# Altium schematic sheet 14 - JLINK Debugger.SchDoc
size B; CompanyName: Microchip Technology Inc.; Organization: Microchip Technology; Address1: 2355 West Chandler Blvd.; Address2: Chandler, AZ  85224; Address4: USA; SheetNumber: 15; SheetTotal: 15; SheetTitle: JLINK Debugger; Time: Time
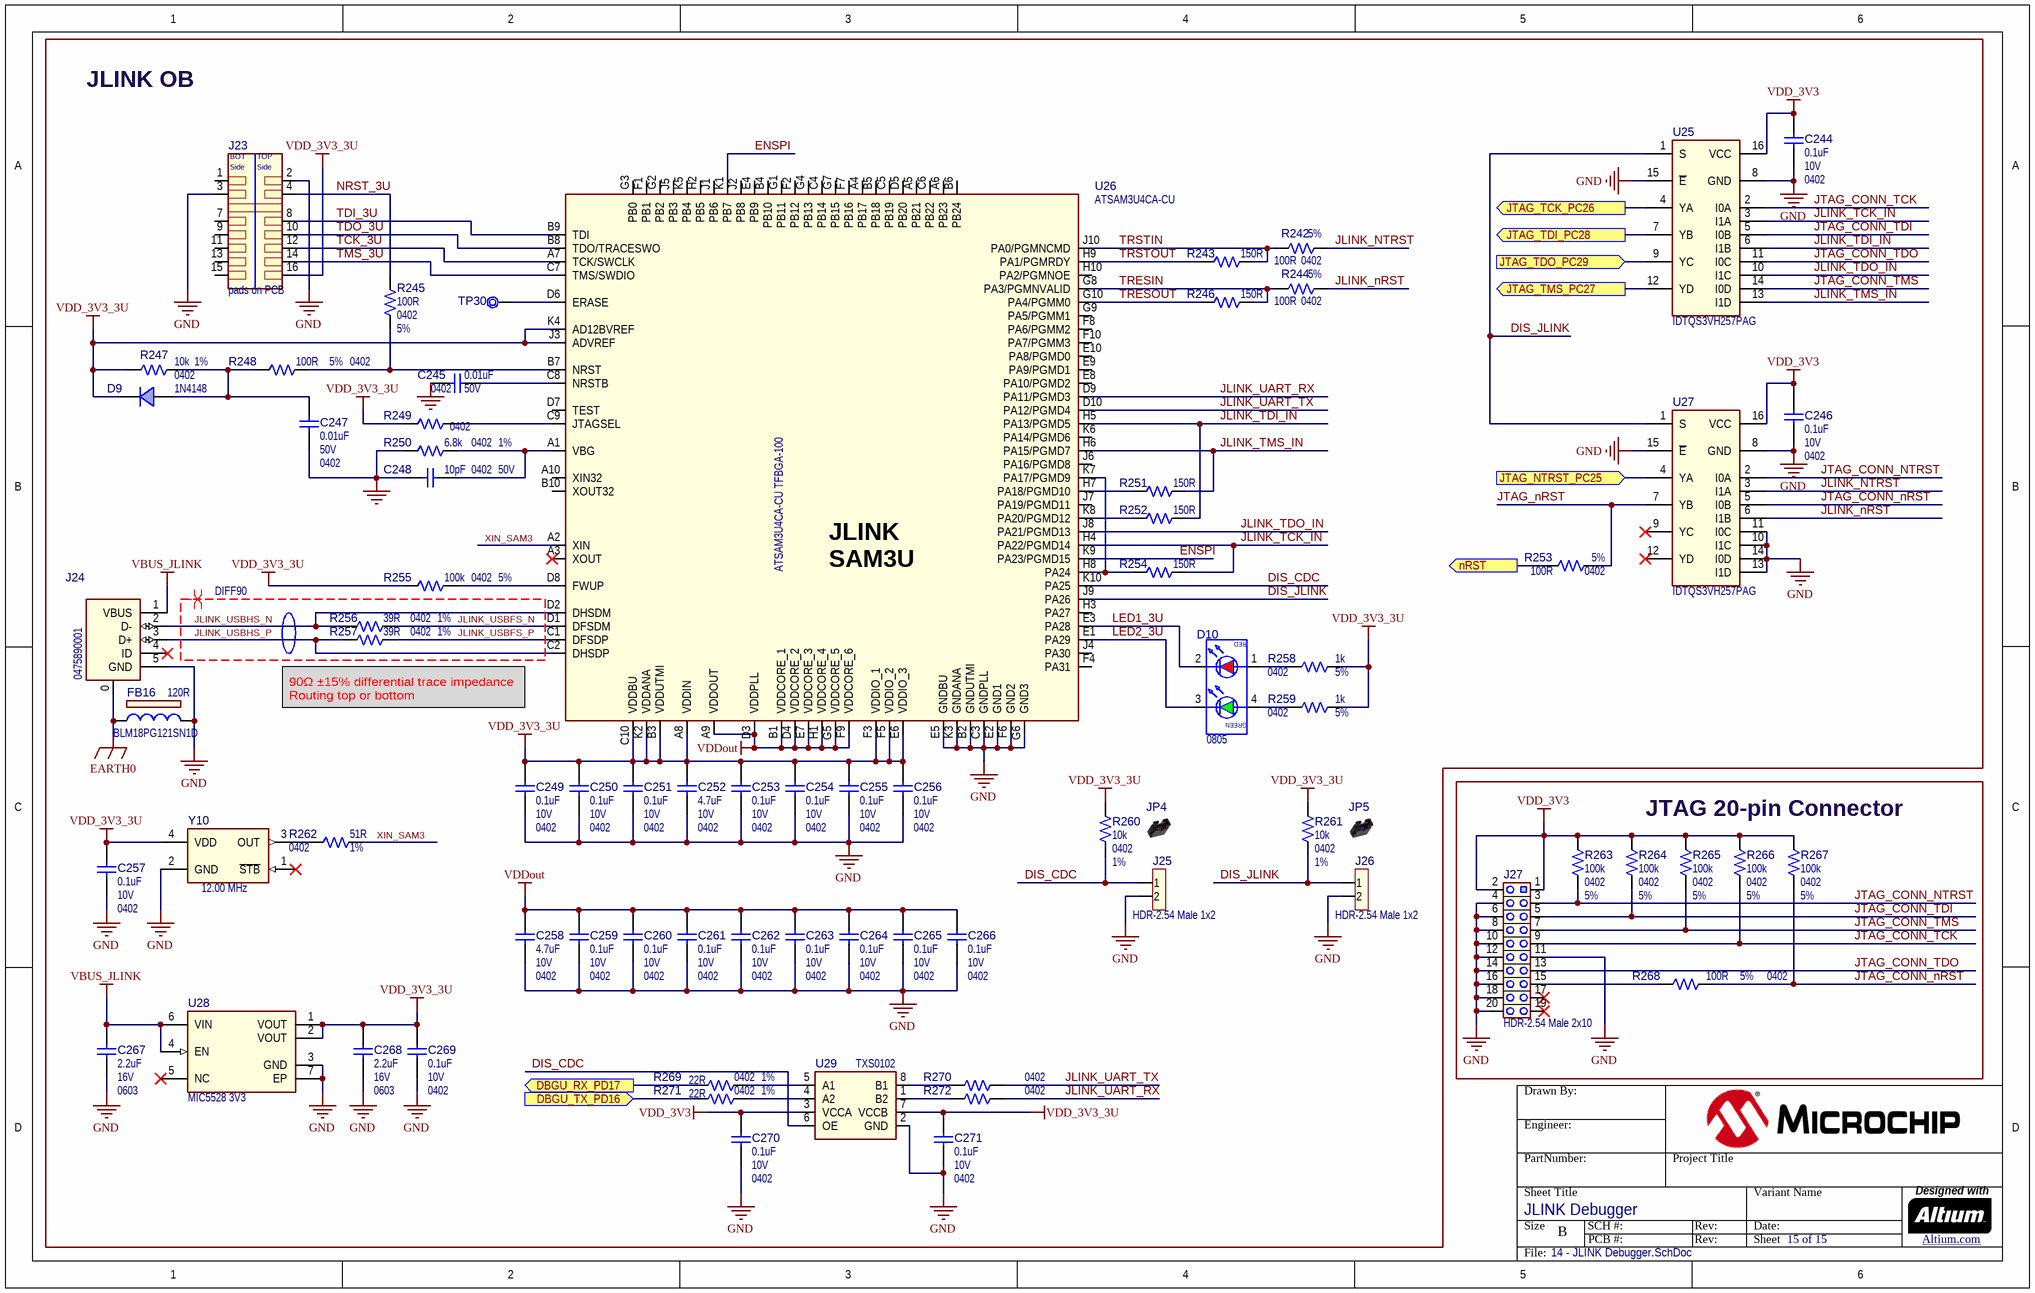
[diagram p0: 14 - JLINK Debugger.SchDoc]

## Parts
?  (no value)  (graphical)
C244  value 0.1uF  Voltage: 10V  Package: 0402  [CAP_C_0402]  (hidden comment: Capacitor NP)
C245  value 0.01uF  Voltage: 50V  Package: 0402  [CAP_C_0402]  (hidden comment: Capacitor NP)
C246  value 0.1uF  Voltage: 10V  Package: 0402  [CAP_C_0402]  (hidden comment: Capacitor NP)
C247  value 0.01uF  Voltage: 50V  Package: 0402  [CAP_C_0402]  (hidden comment: Capacitor NP)
C248  value 10pF  Voltage: 50V  Package: 0402  [CAP_C_0402]  (hidden comment: Capacitor NP)
C249  value 0.1uF  Voltage: 10V  Package: 0402  [CAP_C_0402]  (hidden comment: Capacitor NP)
C250  value 0.1uF  Voltage: 10V  Package: 0402  [CAP_C_0402]  (hidden comment: Capacitor NP)
C251  value 0.1uF  Voltage: 10V  Package: 0402  [CAP_C_0402]  (hidden comment: Capacitor NP)
C252  value 4.7uF  Voltage: 10V  Package: 0402  [CAP_C_0402]  (hidden comment: Capacitor NP)
C253  value 0.1uF  Voltage: 10V  Package: 0402  [CAP_C_0402]  (hidden comment: Capacitor NP)
C254  value 0.1uF  Voltage: 10V  Package: 0402  [CAP_C_0402]  (hidden comment: Capacitor NP)
C255  value 0.1uF  Voltage: 10V  Package: 0402  [CAP_C_0402]  (hidden comment: Capacitor NP)
C256  value 0.1uF  Voltage: 10V  Package: 0402  [CAP_C_0402]  (hidden comment: Capacitor NP)
C257  value 0.1uF  Voltage: 10V  Package: 0402  [CAP_C_0402]  (hidden comment: Capacitor NP)
C258  value 4.7uF  Voltage: 10V  Package: 0402  [CAP_C_0402]  (hidden comment: Capacitor NP)
C259  value 0.1uF  Voltage: 10V  Package: 0402  [CAP_C_0402]  (hidden comment: Capacitor NP)
C260  value 0.1uF  Voltage: 10V  Package: 0402  [CAP_C_0402]  (hidden comment: Capacitor NP)
C261  value 0.1uF  Voltage: 10V  Package: 0402  [CAP_C_0402]  (hidden comment: Capacitor NP)
C262  value 0.1uF  Voltage: 10V  Package: 0402  [CAP_C_0402]  (hidden comment: Capacitor NP)
C263  value 0.1uF  Voltage: 10V  Package: 0402  [CAP_C_0402]  (hidden comment: Capacitor NP)
C264  value 0.1uF  Voltage: 10V  Package: 0402  [CAP_C_0402]  (hidden comment: Capacitor NP)
C265  value 0.1uF  Voltage: 10V  Package: 0402  [CAP_C_0402]  (hidden comment: Capacitor NP)
C266  value 0.1uF  Voltage: 10V  Package: 0402  [CAP_C_0402]  (hidden comment: Capacitor NP)
C267  value 2.2uF  Voltage: 16V  Package: 0603  [CAP_C_0603]  (hidden comment: Capacitor NP)
C268  value 2.2uF  Voltage: 16V  Package: 0603  [CAP_C_0603]  (hidden comment: Capacitor NP)
C269  value 0.1uF  Voltage: 10V  Package: 0402  [CAP_C_0402]  (hidden comment: Capacitor NP)
C270  value 0.1uF  Voltage: 10V  Package: 0402  [CAP_C_0402]  (hidden comment: Capacitor NP)
C271  value 0.1uF  Voltage: 10V  Package: 0402  [CAP_C_0402]  (hidden comment: Capacitor NP)
D9  value 1N4148  [SOD-323]  (hidden comment: Diode Single)
D10  Package: 0805  [LED_DUAL_SMD_2x1.25mm]  (hidden comment: LED DUAL 4 pin)
FB16  value 120R  Manufacturer Part Number 1: BLM18PG121SN1D  [IND_C_0603]  (hidden comment: Ferrite Bead)
J23  pads on PCB  [CON_EDGE-CARD_PCB_RA_MEC1-108-02-F-D-RA1-SL]  (no BOM)
J24  value 0475890001  [CON_USB_Micro-AB_SMD_RA_MOLEX_0475890001]  (hidden comment: CON USB2.0 Mini_Micro)
J25  value HDR-2.54 Male 1x2  [HDR_M_2.54_1x2]  (hidden comment: Header 1x2)
J26  value HDR-2.54 Male 1x2  [HDR_M_2.54_1x2]  (hidden comment: Header 1x2)
J27  value HDR-2.54 Male 2x10  [HDR_M_2.54_2X10_S_TH_V_SAM_TST-110-01-G-D]  (hidden comment: Header 2x10)
JP4  Jumper Mechanical  [Jumper_Mechanical]  (value not drawn)  (mechanical)
JP5  Jumper Mechanical  [Jumper_Mechanical]  (value not drawn)  (mechanical)
R242  value 100R  Package: 0402  Tolerance: 5%  [RES_C_0402]  (hidden comment: Resistor)
R243  value 150R  [RES_C_0402]  (hidden comment: Resistor)
R244  value 100R  Package: 0402  Tolerance: 5%  [RES_C_0402]  (hidden comment: Resistor)
R245  value 100R  Package: 0402  Tolerance: 5%  [RES_C_0402]  (hidden comment: Resistor)
R246  value 150R  [RES_C_0402]  (hidden comment: Resistor)
R247  value 10k  Package: 0402  Tolerance: 1%  [RES_C_0402]  (hidden comment: Resistor)
R248  value 100R  Package: 0402  Tolerance: 5%  [RES_C_0402]  (hidden comment: Resistor)
R249  Package: 0402  [RES_C_0402]  (hidden comment: Resistor)
R250  value 6.8k  Package: 0402  Tolerance: 1%  [RES_C_0402]  (hidden comment: Resistor)
R251  value 150R  [RES_C_0402]  (hidden comment: Resistor)
R252  value 150R  [RES_C_0402]  (hidden comment: Resistor)
R253  value 100R  Package: 0402  Tolerance: 5%  [RES_C_0402]  (hidden comment: Resistor)
R254  value 150R  [RES_C_0402]  (hidden comment: Resistor)
R255  value 100k  Package: 0402  Tolerance: 5%  [RES_C_0402]  (hidden comment: Resistor)
R256  value 39R  Package: 0402  Tolerance: 1%  [RES_C_0402]  (hidden comment: Resistor)
R257  value 39R  Package: 0402  Tolerance: 1%  [RES_C_0402]  (hidden comment: Resistor)
R258  value 1k  Package: 0402  Tolerance: 5%  [RES_C_0402]  (hidden comment: Resistor)
R259  value 1k  Package: 0402  Tolerance: 5%  [RES_C_0402]  (hidden comment: Resistor)
R260  value 10k  Package: 0402  Tolerance: 1%  [RES_C_0402]  (hidden comment: Resistor)
R261  value 10k  Package: 0402  Tolerance: 1%  [RES_C_0402]  (hidden comment: Resistor)
R262  value 51R  Package: 0402  Tolerance: 1%  [RES_C_0402]  (hidden comment: Resistor)
R263  value 100k  Package: 0402  Tolerance: 5%  [RES_C_0402]  (hidden comment: Resistor)
R264  value 100k  Package: 0402  Tolerance: 5%  [RES_C_0402]  (hidden comment: Resistor)
R265  value 100k  Package: 0402  Tolerance: 5%  [RES_C_0402]  (hidden comment: Resistor)
R266  value 100k  Package: 0402  Tolerance: 5%  [RES_C_0402]  (hidden comment: Resistor)
R267  value 100k  Package: 0402  Tolerance: 5%  [RES_C_0402]  (hidden comment: Resistor)
R268  value 100R  Package: 0402  Tolerance: 5%  [RES_C_0402]  (hidden comment: Resistor)
R269  value 22R  Package: 0402  Tolerance: 1%  [RES_C_0402]  (hidden comment: Resistor)
R270  Package: 0402  [RES_C_0402]  (hidden comment: Resistor)
R271  value 22R  Package: 0402  Tolerance: 1%  [RES_C_0402]  (hidden comment: Resistor)
R272  Package: 0402  [RES_C_0402]  (hidden comment: Resistor)
TP30  Test Point No BOM  [TP_1mm_SMD]  (value not drawn)  (no BOM)
U25  value IDTQS3VH257PAG  [TSSOP-16]  (hidden comment: IDTQS3VH257 TSSOP-16)
U26  ATSAM3U4CA-CU TFBGA-100  value ATSAM3U4CA-CU  [TFBGA-100_P0.8_9x9x1.1]
U27  value IDTQS3VH257PAG  [TSSOP-16]  (hidden comment: IDTQS3VH257 TSSOP-16)
U28  value MIC5528 3V3  [DFN-6_1.2x1.2]  (hidden comment: MIC5528MT DFN-6)
U29  TXS0102  [US-8]
Y10  value 12.00 MHz  [OSCILLATOR_DSC60000L2.5W2.0H0.89]  (hidden comment: OSCILLATOR DSC60XX)

## Blocks framed on the sheet
JTAG 20-pin Connector: J27 R263-R268

## Ports
DBGU_RX_PD17 (out), DBGU_TX_PD16 (in), JTAG_NTRST_PC25 (in), JTAG_TCK_PC26 (out), JTAG_TDI_PC28 (out), JTAG_TDO_PC29 (in), JTAG_TMS_PC27 (out), nRST (out)

## Nets
EARTH0: FB16.1 J24.0(SHLD)
GND: C244.2 C245.1 C246.2 C247.1 C248.2 C249.2 C250.1 C251.2 C252.1 C253.1 C254.1 C255.1 C256.1 C257.1 C258.1 C259.1 C260.2 C261.2 C262.2 C263.2 C264.2 C265.2 C266.1 C267.2 C268.1 C269.1 C270.1 C271.1 FB16.2 J23.2 J23.3 J24.5(GND) J25.2 J26.2 J27.4 J27.6 J27.8 J27.10 J27.11 J27.12 J27.14 J27.16 J27.18 J27.20 R250.1 U25.8(GND) U25.15(~{E}) U26.B2(GNDUTMI) U26.C3(GNDPLL) U26.E2(GND1) U26.E5(GNDBU) U26.F6(GND2) U26.G6(GND3) U26.K3(GNDANA) U27.8(GND) U27.10(I1C) U27.11(I0C) U27.13(I1D) U27.14(I0D) U27.15(~{E}) U28.3(GND) U28.7(EP) U29.2(GND) Y10.2(GND)
VBUS_JLINK: C267.1 J24.1(VBUS) U28.4(EN) U28.6(VIN)
VDD_3V3: C244.1 C246.1 C270.2 J27.1 J27.2 R263.2 R264.2 R265.2 R266.1 R267.2 U25.16(VCC) U27.16(VCC) U29.3(VCCA)
VDD_3V3_3U: C249.1 C250.2 C251.1 C252.2 C253.2 C254.2 C255.2 C256.2 C257.2 C268.2 C269.2 C271.2 D9.2(K) J23.16 R247.1 R249.1 R255.1 R258.1 R259.1 R260.1 R261.1 U26.A8(VDDIN) U26.B3(VDDUTMI) U26.C10(VDDBU) U26.E6(VDDIO_3) U26.F3(VDDIO_1) U26.F5(VDDIO_2) U26.J3(ADVREF) U26.K2(VDDANA) U26.K4(AD12BVREF) U28.1(VOUT) U28.2(VOUT) U29.7(VCCB) Y10.4(VDD)
VDDout: C258.2 C259.2 C260.1 C261.1 C262.1 C263.1 C264.1 C265.1 C266.2 U26.A9(VDDOUT) U26.B1(VDDCORE_1) U26.D3(VDDPLL) U26.D4(VDDCORE_2) U26.E7(VDDCORE_3) U26.F9(VDDCORE_6) U26.G5(VDDCORE_5) U26.H1(VDDCORE_4)
DBGU_RX_PD17: R269.1 ; port DBGU_RX_PD17
DBGU_TX_PD16: R271.1 ; port DBGU_TX_PD16
DIS_CDC: J25.1 R260.2 U26.K10(PA25) U29.6(OE)
DIS_JLINK: J26.1 R261.2 U25.1(S) U26.J9(PA26) U27.1(S)
ENSPI: U26.K1(PB7) U26.K9(PA23/PGMD15)
JLINK_nRST: R244.2 U27.6(I1B)
JLINK_NTRST: R242.2 U27.3(I1A)
JLINK_TCK_IN: R254.2 U25.3(I1A) U26.H4(PA22/PGMD14)
JLINK_TDI_IN: R252.2 U25.6(I1B) U26.H5(PA13/PGMD5)
JLINK_TDO_IN: U25.10(I1C) U26.J8(PA21/PGMD13)
JLINK_TMS_IN: R251.2 U25.13(I1D) U26.H6(PA15/PGMD7)
JLINK_UART_RX: R272.2 U26.D9(PA11/PGMD3)
JLINK_UART_TX: R270.2 U26.D10(PA12/PGMD4)
JLINK_USBFS_N: R256.2 U26.D1(DFSDM)
JLINK_USBFS_P: R257.2 U26.C1(DFSDP)
JLINK_USBHS_N: J24.2(D-) R256.1 U26.D2(DHSDM)
JLINK_USBHS_P: J24.3(D+) R257.1 U26.C2(DHSDP)
JTAG_CONN_nRST: R267.1 R268.1 U27.5(I0B)
JTAG_CONN_NTRST: J27.3 R263.1 U27.2(I0A)
JTAG_CONN_TCK: J27.9 R266.2 U25.2(I0A)
JTAG_CONN_TDI: J27.5 R264.1 U25.5(I0B)
JTAG_CONN_TDO: J27.13 U25.11(I0C)
JTAG_CONN_TMS: J27.7 R265.1 U25.14(I0D)
JTAG_nRST: R253.2 U27.7(YB)
JTAG_NTRST_PC25: U27.4(YA) ; port JTAG_NTRST_PC25
JTAG_TCK_PC26: U25.4(YA) ; port JTAG_TCK_PC26
JTAG_TDI_PC28: U25.7(YB) ; port JTAG_TDI_PC28
JTAG_TDO_PC29: U25.9(YC) ; port JTAG_TDO_PC29
JTAG_TMS_PC27: U25.12(YD) ; port JTAG_TMS_PC27
LED1_3U: D10.2(K1) U26.E3(PA28)
LED2_3U: D10.3(K2) U26.E1(PA29)
nRST: R253.1 ; port nRST
NRST_3U: J23.4 R245.2
TCK_3U: J23.12 U26.A7(TCK/SWCLK)
TDI_3U: J23.8 U26.B9(TDI)
TDO_3U: J23.10 U26.B8(TDO/TRACESWO)
TMS_3U: J23.14 U26.C7(TMS/SWDIO)
TRESIN: R244.1 R246.2 U26.G8(PA3/PGMNVALID)
TRESOUT: R246.1 U26.G10(PA4/PGMM0)
TRSTIN: R242.1 R243.2 U26.J10(PA0/PGMNCMD)
TRSTOUT: R243.1 U26.H9(PA1/PGMRDY)
XIN_SAM3: R262.2 U26.A2(XIN)
NetC245_2: C245.2 U26.C8(NRSTB)
NetC247_2: C247.2 D9.1(A) R247.2 R248.1
NetC248_1: C248.1 R250.2 U26.A1(VBG)
NetD10_1: D10.1(A1) R258.2
NetD10_4: D10.4(A2) R259.2
NetJ27_15: J27.15 R268.2
NetR245_1: R245.1 R248.2 U26.B7(NRST)
NetR249_2: R249.2 U26.C9(JTAGSEL)
NetR251_1: R251.1 U26.H7(PA18/PGMD10)
NetR252_1: R252.1 U26.K8(PA20/PGMD12)
NetR254_1: R254.1 U26.H8(PA24) U26.K7(PA17/PGMD9)
NetR255_2: R255.2 U26.D8(FWUP)
NetR262_1: R262.1 Y10.3(OUT)
NetR269_2: R269.2 U29.5(A1)
NetR270_1: R270.1 U29.8(B1)
NetR271_2: R271.2 U29.4(A2)
NetR272_1: R272.1 U29.1(B2)
NetTP30_1: TP30.1 U26.D6(ERASE)

Not connected (* = marked no-connect by the designer): J23 1 7 9 11 13 15; J24 4(ID)*; J27 17* 19*; U26 A3(XOUT)* A4(PB17) A5(PB21) A6(PB23) A10(XIN32) B4(PB10) B5(PB18) B6(PB24) B10(XOUT32) C4(PB14) C5(PB19) C6(PB22) D5(PB20) D7(TEST) E4(PB9) E8(PA10/PGMD2) E9(PA9/PGMD1) E10(PA8/PGMD0) F1(PB1) F2(PB12) F4(PA31) F7(PB16) F8(PA6/PGMM2) F10(PA7/PGMM3) G1(PB11) G2(PB2) G3(PB0) G4(PB13) G7(PB15) G9(PA5/PGMM1) H2(PB5) H3(PA27) H10(PA2/PGMNOE) J1(PB6) J2(PB8) J4(PA30) J5(PB3) J6(PA16/PGMD8) J7(PA19/PGMD11) K5(PB4) K6(PA14/PGMD6); U27 9(YC)* 12(YD)*; U28 5(NC)*; Y10 1(~{STB})*

## Layout directives
differential pair; differential pair class DIFF90; net class DIFF90; rule Matched Net Lengths [Tolerance = 0.1mm]: JLINK_USBFS_N, JLINK_USBFS_P, JLINK_USBHS_N, JLINK_USBHS_P

## Notes on the sheet
- JLINK OB
- (near U26) JLINK
  SAM3U
- 90Ω ±15% differential trace impedance
  Routing top or bottom
- Drawn By:
- Engineer:
- PartNumber:
- Project Title
- Sheet Title
- Size
- B
- SCH #:
- PCB #:
- Rev:
- Variant Name
- Date:
- Sheet
- Designed with
- Altium.com <http://go.altium.com/MicrochipLandingPage_Evaluation.html>
- File:
- (in symbol CON1674) BOT; TOP; Side
- (in symbol DIODE1110) RED; GREEN

## Library data of the parts
? = Title Block B
C244 C246 C249-C251 C253-C257 C259-C266 C269-C271 = CAP1238: Capacitor; Manufacturer 1: KEMET; Manufacturer Part Number 1: C0402C104K8RACTU; Description_: CAP CER 0.1uF 10V 10% X7R SMD 0402; Dev Tools Status: Production; Tolerance: 10%; Temperature Coeffcient: X7R; Type: Ceramic; Owner: Tad Ahlvers; Populated: YES; MCHP-ID: CAP1238; Revision: 1; Symbol: Capacitor NP; Status: MCL Design; ComponentLink1URL: https://chn-vm-apps.microchip.com/mchprepo/parts/Datasheets/KEM_C1002_X7R_SMD.pdf; ComponentLink1Description: SVN Datasheet; ComponentLink2URL: C:\ALTIUM_WORK\00001_MCHP-CDB\Datasheets\KEM_C1002_X7R_SMD.pdf; ComponentLink2Description: Local Datasheet; ComponentLink3URL: C:\ALTIUM_WORK\00001_MCHP-CDB\Library\LibraryRefs\Capacitor NP.SchLib; ComponentLink3Description: Open Symbol; ComponentLink4URL: C:\ALTIUM_WORK\00001_MCHP-CDB\Library\Footprints\CAP_C_0402.PcbLib; ComponentLink4Description: Open Footprint; ComponentLink5Description: Open Footprint 2; ComponentLink6Description: Open Footprint 3; ComponentLink7Description: Open Footprint 4; Operating Temperature: -55C to +125C; Category: Capacitor; Supplier 1: Digi-Key; Supplier Part Number 1: 399-3520-2-ND; Quantity Override: 1; Manufacturer 2: Samsung; Manufacturer Part Number 2: CL05B104KP5NNNC; Manufacturer 3: Murata Electronics; Manufacturer Part Number 3: GRM155R71A104KA01D; Supplier 2: Digi-Key; Supplier Part Number 2: 1276-1002-2-ND; Supplier 3: Mouser; Supplier Part Number 3: 81-GRM155R71A104KA1D
C245 C247 = CAP2026: Capacitor; Manufacturer 1: TDK Corporation; Manufacturer Part Number 1: CGA2B3X7R1H103K050BB; Description_: CAP CER 0.01uF 50V 10% X7R SMD 0402; Dev Tools Status: Design; Tolerance: 10%; Temperature Coeffcient: X7R; Type: Ceramic; Populated: YES; Owner: Gabor Bihari; MCHP-ID: CAP2026; Revision: A; Symbol: Capacitor NP; Status: MCL Design; ComponentLink1URL: https://chn-vm-apps.microchip.com/mchprepo/parts/Datasheets/mlcc_automotive_general_en.pdf; ComponentLink1Description: SVN Datasheet; ComponentLink2URL: C:\ALTIUM_WORK\00001_MCHP-CDB\Datasheets\mlcc_automotive_general_en.pdf; ComponentLink2Description: Local Datasheet; ComponentLink3URL: C:\ALTIUM_WORK\00001_MCHP-CDB\Library\LibraryRefs\Capacitor NP.SchLib; ComponentLink3Description: Open Symbol; ComponentLink4URL: C:\ALTIUM_WORK\00001_MCHP-CDB\Library\Footprints\CAP_C_0402.PcbLib; ComponentLink4Description: Open Footprint; ComponentLink5Description: Open Footprint 2; ComponentLink6Description: Open Footprint 3; ComponentLink7Description: Open Footprint 4; Operating Temperature: -55C to +125C; Category: Capacitor; Supplier 1: Digi-Key; Supplier Part Number 1: 445-6893-1-ND; Quantity Override: 1
C248 = CAP2117: Manufacturer 1: Samsung Electro-Mechanics; Manufacturer Part Number 1: CL05C100JB51PNC; Description_: CAP CER 10pF 5% 50V C0G/NP0 SMD 0402 AEC-Q200; Dev Tools Status: Design; Tolerance: 5%; Temperature Coeffcient: NP0; Type: Ceramic; Populated: YES; Owner: Gabor Bihari; MCHP-ID: CAP2117; Revision: A; Symbol: Capacitor NP; Status: MCL Design; ComponentLink1URL: https://chn-vm-apps.microchip.com/mchprepo/parts/Datasheets/MLCC.pdf; ComponentLink1Description: SVN Datasheet; ComponentLink2URL: C:\ALTIUM_WORK\00001_MCHP-CDB\Datasheets\MLCC.pdf; ComponentLink2Description: Local Datasheet; ComponentLink3URL: C:\ALTIUM_WORK\00001_MCHP-CDB\Library\LibraryRefs\Capacitor NP.SchLib; ComponentLink3Description: Open Symbol; ComponentLink4URL: C:\ALTIUM_WORK\00001_MCHP-CDB\Library\Footprints\CAP_C_0402.PcbLib; ComponentLink4Description: Open Footprint; ComponentLink5Description: Open Footprint 2; ComponentLink6Description: Open Footprint 3; ComponentLink7Description: Open Footprint 4; Operating Temperature: -55°C - 125°C; Category: Capacitor; Supplier 1: Digi-Key; Supplier Part Number 1: 1276-1626-1-ND; Quantity Override: 1
C252 C258 = CAP1684: Capacitor; Manufacturer 1: TDK Corporation; Manufacturer Part Number 1: C1005X5R1A475K050BC; Description_: CAP CER 4.7uF 10V 10% X5R SMD 0402; Dev Tools Status: Design; Tolerance: 10%; Temperature Coeffcient: X5R; Type: Ceramic; Owner: Jesus Aviles; Populated: YES; MCHP-ID: CAP1684; Revision: B; Symbol: Capacitor NP; Status: MCL Design; ComponentLink1Description: SVN Datasheet; ComponentLink2Description: Local Datasheet; ComponentLink3URL: C:\ALTIUM_WORK\00001_MCHP-CDB\Library\LibraryRefs\Capacitor NP.SchLib; ComponentLink3Description: Open Symbol; ComponentLink4URL: C:\ALTIUM_WORK\00001_MCHP-CDB\Library\Footprints\CAP_C_0402.PcbLib; ComponentLink4Description: Open Footprint; ComponentLink5Description: Open Footprint 2; ComponentLink6Description: Open Footprint 3; ComponentLink7Description: Open Footprint 4; Operating Temperature: -55C to 85C; Category: Capacitor; Supplier 1: Digi-Key; Supplier Part Number 1: 445-13820-1-ND; Quantity Override: 1
C267 C268 = CAP0597: Capacitor; Manufacturer 1: TDK; Manufacturer Part Number 1: C1608X5R1C225K; Description_: CAP CER 2.2uF 16V 10% X5R SMD 0603; Dev Tools Status: Production; Tolerance: 10%; Temperature Coeffcient: X5R; Type: Ceramic; Populated: Yes; MCHP-ID: CAP0597; Revision: 2; Symbol: Capacitor NP; Status: MCL Design; ComponentLink1URL: https://chn-vm-apps.microchip.com/mchprepo/parts/Datasheets/general_B11.pdf; ComponentLink1Description: SVN Datasheet; ComponentLink2URL: C:\ALTIUM_WORK\00001_MCHP-CDB\Datasheets\general_B11.pdf; ComponentLink2Description: Local Datasheet; ComponentLink3URL: C:\ALTIUM_WORK\00001_MCHP-CDB\Library\LibraryRefs\Capacitor NP.SchLib; ComponentLink3Description: Open Symbol; ComponentLink4URL: C:\ALTIUM_WORK\00001_MCHP-CDB\Library\Footprints\CAP_C_0603.PcbLib; ComponentLink4Description: Open Footprint; ComponentLink5Description: Open Footprint 2; ComponentLink6Description: Open Footprint 3; ComponentLink7Description: Open Footprint 4; Operating Temperature: -55C to +85C; Category: Capacitor; Supplier 1: Digi-Key; Supplier Part Number 1: 445-5157-1-ND; Quantity Override: 1
D9 = DIODE0096: DIO RECT 1N4148 855mV 300mA 75V SOD-323; Manufacturer 1: Diodes Incorporated; Manufacturer Part Number 1: 1N4148WS-7-F; Dev Tools Status: Production; Type: Rectifier Single; Power: 200mW; Reverse Current: 50uA; Populated: Yes; MCHP-ID: DIODE0096; Revision: 1; Symbol: Diode Single; Description_: DIO RECT 1N4148 855mV 300mA 75V SOD-323; Status: MCL Design; Package: SOD-323; ComponentLink1URL: https://chn-vm-apps.microchip.com/mchprepo/parts/Datasheets/ds30097.pdf; ComponentLink1Description: SVN Datasheet; ComponentLink2URL: C:\ALTIUM_WORK\00001_MCHP-CDB\Datasheets\ds30097.pdf; ComponentLink2Description: Local Datasheet; ComponentLink3URL: C:\ALTIUM_WORK\00001_MCHP-CDB\Library\LibraryRefs\Diode Single.SchLib; ComponentLink3Description: Open Symbol; ComponentLink4URL: C:\ALTIUM_WORK\00001_MCHP-CDB\Library\Footprints\SOD-323.PcbLib; ComponentLink4Description: Open Footprint; ComponentLink5Description: Open Footprint 2; ComponentLink6Description: Open Footprint 3; ComponentLink7Description: Open Footprint 4; Operating Temperature: -65C to +150C; Category: Diode; Forward Current: 300mA; Reverse Voltage: 75V; Manufacturer 2: Diodes Incorporated; Manufacturer Part Number 2: 1N4148WS-7; Supplier 1: Digi-Key; Supplier Part Number 1: 1N4148WS-FDICT-ND; Supplier 2: Digi-Key; Supplier Part Number 2: 1N4148WSDITR-ND; Quantity Override: 1
D10 = DIODE1110: LED; Manufacturer 1: Kingbright Corp; Manufacturer Part Number 1: APHBM2012SURKCGKC; Value: RED, GREEN; Description_: DIO LED BI RED, GREEN 1.95V, 2.1V 30mA 0805; Dev Tools Status: Production; Type: LED Bicolor; Forward Current: 30mA; Power: 75mW; Reverse Current: 10uA; Owner: Bogdan P (M91398); Populated: Yes; MCHP-ID: DIODE1110; Revision: 0; Symbol: LED DUAL 4 PIN; Status: MCL Design; ComponentLink1URL: https://chn-vm-apps.microchip.com/mchprepo/parts/Datasheets/APHBM2012SURKCGKC.pdf; ComponentLink1Description: SVN Datasheet; ComponentLink2URL: C:\ALTIUM_WORK\00001_MCHP-CDB\Datasheets\APHBM2012SURKCGKC.pdf; ComponentLink2Description: Local Datasheet; ComponentLink3URL: C:\ALTIUM_WORK\00001_MCHP-CDB\Library\LibraryRefs\LED DUAL 4 PIN.SchLib; ComponentLink3Description: Open Symbol; ComponentLink4URL: C:\ALTIUM_WORK\00001_MCHP-CDB\Library\Footprints\LED_DUAL_SMD_2x1.25mm.PcbLib; ComponentLink4Description: Open Footprint; ComponentLink5Description: Open Footprint 2; ComponentLink6Description: Open Footprint 3; ComponentLink7Description: Open Footprint 4; Operating Temperature: -40C to +85C; Category: Diode; Supplier 1: Digi-Key; Supplier Part Number 1: 754-1093-1-ND; Quantity Override: 1
FB16 = IND1009: Manufacturer 1: Murata; Description_: FERRITE 120R@100MHz 2A SMD 0603; Dev Tools Status: Production; Owner: Petnarong Chaijaroong; DCR: 0.05R; Saturation Current: 12A; Populated: Yes; MCHP-ID: IND1009; Revision: 0; Symbol: Ferrite Bead; Status: MCL Design; ComponentLink1URL: https://chn-vm-apps.microchip.com/mchprepo/parts/Datasheets/L0110S0100BLM18P.pdf; ComponentLink1Description: SVN Datasheet; ComponentLink2URL: C:\ALTIUM_WORK\00001_MCHP-CDB\Datasheets\L0110S0100BLM18P.pdf; ComponentLink2Description: Local Datasheet; ComponentLink3URL: C:\ALTIUM_WORK\00001_MCHP-CDB\Library\LibraryRefs\Ferrite Bead.SchLib; ComponentLink3Description: Open Symbol; ComponentLink4URL: C:\ALTIUM_WORK\00001_MCHP-CDB\Library\Footprints\IND_C_0603.PcbLib; ComponentLink4Description: Open Footprint; ComponentLink5Description: Open Footprint 2; ComponentLink6Description: Open Footprint 3; ComponentLink7Description: Open Footprint 4; Operating Temperature: -55C to +125C; Package: 0603; Type: Ferrite Bead; Category: Inductor; Supplier 1: Digi-Key; Supplier Part Number 1: 490-1037-1-ND; Quantity Override: 1
J23 = CON1674: CON_PCB_MEC1-108-02-F-D-RA1-SL; Manufacturer 1: Samtec Inc.; Description_: CON EDGE MEC1 1mm 14P Male PCB VERT; Dev Tools Status: Design; Owner: Dragos Danaila; Current: 1.6A; Populated: NO; MCHP-ID: CON1674; Revision: C; Symbol: CON_PCB_MEC1-108-02-F-D-RA1-SL; Status: MCL Design; ComponentLink1URL: https://chn-vm-apps.microchip.com/mchprepo/parts/Datasheets/mec1-1xx-xx-x-d-rax-x-sl-footprint.pdf; ComponentLink1Description: SVN Datasheet; ComponentLink2URL: C:\ALTIUM_WORK\00001_MCHP-CDB\Datasheets\mec1-1xx-xx-x-d-rax-x-sl-footprint.pdf; ComponentLink2Description: Local Datasheet; ComponentLink3URL: C:\ALTIUM_WORK\00001_MCHP-CDB\Library\LibraryRefs\CON_PCB_MEC1-108-02-F-D-RA1-SL.SchLib; ComponentLink3Description: Open Symbol; ComponentLink4URL: C:\ALTIUM_WORK\00001_MCHP-CDB\Library\Footprints\CON_EDGE-CARD_PCB_RA_MEC1-108-02-F-D-RA1-SL.PcbLib; ComponentLink4Description: Open Footprint; ComponentLink5Description: Open Footprint 2; ComponentLink6Description: Open Footprint 3; ComponentLink7Description: Open Footprint 4; Type: Edge Card; Category: Connector; Manufacturer Part Number 1: MEC1-108-02-F-D-RA1-SL; Supplier 1: Digi-Key; Supplier Part Number 1: SAM11473-ND; Quantity Override: 1
J24 = CON1753: Manufacturer 1: Molex, LLC; Description_: CON USB2.0 MICRO-AB FEMALE SMD R/A; Dev Tools Status: Design; Owner: Dragos Danaila; Populated: YES; Voltage: 30VAC; Current: 1A, 1.8A; Custom Parameters: 10000 mating cycles; MCHP-ID: CON1753; Revision: A; Symbol: CON USB2.0 Mini_Micro; Status: MCL Design; ComponentLink1URL: https://chn-vm-apps.microchip.com/mchprepo/parts/Datasheets/475890001_sd.pdf; ComponentLink1Description: SVN Datasheet; ComponentLink2URL: C:\ALTIUM_WORK\00001_MCHP-CDB\Datasheets\475890001_sd.pdf; ComponentLink2Description: Local Datasheet; ComponentLink3URL: C:\ALTIUM_WORK\00001_MCHP-CDB\Library\LibraryRefs\CON USB2.0 Mini_Micro.SchLib; ComponentLink3Description: Open Symbol; ComponentLink4URL: C:\ALTIUM_WORK\00001_MCHP-CDB\Library\Footprints\CON_USB_Micro-AB_SMD_RA_MOLEX_0475890001.PcbLib; ComponentLink4Description: Open Footprint; ComponentLink5Description: Open Footprint 2; ComponentLink6Description: Open Footprint 3; ComponentLink7Description: Open Footprint 4; Type: USB; Category: Connector; Manufacturer Part Number 1: 0475890001; Supplier 1: Digi-Key; Supplier Part Number 1: WM17143CT-ND; Quantity Override: 1
J25 J26 = CON1312: Manufacturer 1: Sullins Connector Solutions; Manufacturer Part Number 1: PREC002SAAN-RC; Description_: CON HDR-2.54 Male 1x2 Tin 5.84MH TH VERT; Dev Tools Status: Production; Owner: Randolph Sobrepena; Populated: YES; MCHP-ID: CON1312; Revision: 2; Symbol: Header 1x2; Status: MCL Design; ComponentLink1URL: https://chn-vm-apps.microchip.com/mchprepo/parts/Datasheets/z RzCzzzSzzN-RC, ST,11635-B.pdf; ComponentLink1Description: SVN Datasheet; ComponentLink2URL: C:\ALTIUM_WORK\00001_MCHP-CDB\Datasheets\z RzCzzzSzzN-RC, ST,11635-B.pdf; ComponentLink2Description: Local Datasheet; ComponentLink3URL: C:\ALTIUM_WORK\00001_MCHP-CDB\Library\LibraryRefs\Header 1x2.SchLib; ComponentLink3Description: Open Symbol; ComponentLink4URL: C:\ALTIUM_WORK\00001_MCHP-CDB\Library\Footprints\HDR_M_2.54_1x2.PcbLib; ComponentLink4Description: Open Footprint; ComponentLink5Description: Open Footprint 2; ComponentLink6Description: Open Footprint 3; ComponentLink7Description: Open Footprint 4; Type: Header 2.54mm; Category: Connector; Manufacturer 2: SHENZHEN JUNHAO ENGINEERING; Manufacturer Part Number 2: R-211-0211-0021-000; Supplier 1: Digi-Key; Supplier Part Number 1: S1012EC-02-ND; Supplier 2: Raynen; Supplier Part Number 2: CONN00252C01M; Quantity Override: 1
J27 = CON1576: Manufacturer 1: Samtec; Manufacturer Part Number 1: TST-110-01-G-D; Description_: CON HDR-2.54 Male 2x10 Gold Shroud 6.35MH TH VERT; Dev Tools Status: Production; Owner: Randolph Sobrepena; Populated: YES; MCHP-ID: CON1576; Revision: 1; Symbol: Header 2x10; Status: MCL Design; ComponentLink1URL: https://chn-vm-apps.microchip.com/mchprepo/parts/Datasheets/tst-mkt.pdf; ComponentLink1Description: SVN Datasheet; ComponentLink2URL: C:\ALTIUM_WORK\00001_MCHP-CDB\Datasheets\tst-mkt.pdf; ComponentLink2Description: Local Datasheet; ComponentLink3URL: C:\ALTIUM_WORK\00001_MCHP-CDB\Library\LibraryRefs\Header 2x10.SchLib; ComponentLink3Description: Open Symbol; ComponentLink4URL: C:\ALTIUM_WORK\00001_MCHP-CDB\Library\Footprints\HDR_M_2.54_2X10_S_TH_V_SAM_TST-110-01-G-D.PcbLib; ComponentLink4Description: Open Footprint; ComponentLink5Description: Open Footprint 2; ComponentLink6Description: Open Footprint 3; ComponentLink7Description: Open Footprint 4; Type: Header 2.54mm; Category: Connector; Supplier 1: Digi-Key; Supplier Part Number 1: SAM8994-ND; Quantity Override: 1; Manufacturer 2: Greenconn; Manufacturer Part Number 2: GPHA204-1002A001B1BB; Supplier 2: Greenconn; Supplier Part Number 2: GPHA204-1002A001B1BB
JP4 JP5 = MECH0174: Manufacturer 1: Wurth Electronics Inc.; Manufacturer Part Number 1: 60900213421; Value: Shunt 2.54mm 1x2; Description_: MECH HW JUMPER 2.54mm 1x2 GOLD; Dev Tools Status: Production; Owner: Narasimha Murthy; Populated: MECH; MCHP-ID: MECH0174; Revision: 1; Symbol: Jumper Mechanical; Status: MCL Design; ComponentLink1URL: https://chn-vm-apps.microchip.com/mchprepo/parts/Datasheets/60900213421.pdf; ComponentLink1Description: SVN Datasheet; ComponentLink2URL: C:\ALTIUM_WORK\00001_MCHP-CDB\Datasheets\60900213421.pdf; ComponentLink2Description: Local Datasheet; ComponentLink3URL: C:\ALTIUM_WORK\00001_MCHP-CDB\Library\LibraryRefs\Jumper Mechanical.SchLib; ComponentLink3Description: Open Symbol; ComponentLink4URL: C:\ALTIUM_WORK\00001_MCHP-CDB\Library\Footprints\Jumper_Mechanical.PcbLib; ComponentLink4Description: Open Footprint; ComponentLink5Description: Open Footprint 2; ComponentLink6Description: Open Footprint 3; ComponentLink7Description: Open Footprint 4; Type: Jumper; Category: Hardware; Supplier 1: Digi-Key; Supplier Part Number 1: 732-2678-ND; Quantity Override: 1
R242 R244 R245 R248 R253 R268 = RES2692: Manufacturer 1: Bourns Inc.; Manufacturer Part Number 1: CR0402AJW-101GAS; Description_: RES TKF 100R 5% 1/10W SMD 0402; Dev Tools Status: Design; Voltage: 50V; Temperature Coeffcient: 200ppm/C; Power: 1/16W; Owner: Dragos Danaila; Populated: YES; MCHP-ID: RES2692; Revision: 1; Symbol: Resistor; Status: MCL Design; ComponentLink1URL: https://chn-vm-apps.microchip.com/mchprepo/parts/Datasheets/crxxxxa-as.pdf; ComponentLink1Description: SVN Datasheet; ComponentLink2URL: C:\ALTIUM_WORK\00001_MCHP-CDB\Datasheets\crxxxxa-as.pdf; ComponentLink2Description: Local Datasheet; ComponentLink3URL: C:\ALTIUM_WORK\00001_MCHP-CDB\Library\LibraryRefs\Resistor.SchLib; ComponentLink3Description: Open Symbol; ComponentLink4URL: C:\ALTIUM_WORK\00001_MCHP-CDB\Library\Footprints\RES_C_0402.PcbLib; ComponentLink4Description: Open Footprint; ComponentLink5Description: Open Footprint 2; ComponentLink6Description: Open Footprint 3; ComponentLink7Description: Open Footprint 4; Operating Temperature: -55C to +155C; Category: Resistor; Type: RES SMD; Composition: TKF; Supplier 1: Digikey; Supplier Part Number 1: CR0402AJW-101GASTR-ND; Quantity Override: 1
R243 R246 R251 R252 R254 = RSMT1167: Manufacturer 1: Vishay Dale; Manufacturer Part Number 1: CRCW0402150RFKED; Description_: RES TKF 150R 1% 1/16W MF 0402; Dev Tools Status: Production; Owner: Jamus Griego; Populated: YES; MCHP-ID: RSMT1167; Revision: 1; Symbol: Resistor; Status: MCL Design; ComponentLink1URL: https://chn-vm-apps.microchip.com/mchprepo/parts/Datasheets/dcrcwe3.pdf; ComponentLink1Description: SVN Datasheet; ComponentLink2URL: C:\ALTIUM_WORK\00001_MCHP-CDB\Datasheets\dcrcwe3.pdf; ComponentLink2Description: Local Datasheet; ComponentLink3URL: C:\ALTIUM_WORK\00001_MCHP-CDB\Library\LibraryRefs\Resistor.SchLib; ComponentLink3Description: Open Symbol; ComponentLink4URL: C:\ALTIUM_WORK\00001_MCHP-CDB\Library\Footprints\RES_C_0402.PcbLib; ComponentLink4Description: Open Footprint; ComponentLink5Description: Open Footprint 2; ComponentLink6Description: Open Footprint 3; ComponentLink7Description: Open Footprint 4; Category: Resistor; Type: RES SMD; Supplier 1: Digi-Key; Supplier Part Number 1: 541-150LCT-ND; Quantity Override: 1
R247 R260 R261 = RSMT1019: Manufacturer 1: Panasonic; Manufacturer Part Number 1: ERJ-2RKF1002X; Description_: RES TKF 10k 1% 1/10W SMD 0402; Dev Tools Status: Production; Voltage: 50V; Temperature Coeffcient: 100ppm/C; Power: 1/10W; Populated: Yes; Owner: Brent Lanphear; MCHP-ID: RSMT1019; Revision: 2; Symbol: Resistor; Status: MCL Design; ComponentLink1URL: https://chn-vm-apps.microchip.com/mchprepo/parts/Datasheets/AOA0000CE2.pdf; ComponentLink1Description: SVN Datasheet; ComponentLink2URL: C:\ALTIUM_WORK\00001_MCHP-CDB\Datasheets\AOA0000CE2.pdf; ComponentLink2Description: Local Datasheet; ComponentLink3URL: C:\ALTIUM_WORK\00001_MCHP-CDB\Library\LibraryRefs\Resistor.SchLib; ComponentLink3Description: Open Symbol; ComponentLink4URL: C:\ALTIUM_WORK\00001_MCHP-CDB\Library\Footprints\RES_C_0402.PcbLib; ComponentLink4Description: Open Footprint; ComponentLink5Description: Open Footprint 2; ComponentLink6Description: Open Footprint 3; ComponentLink7Description: Open Footprint 4; Operating Temperature: -55C to +155C; Category: Resistor; Type: RES SMD; Composition: TKF; Supplier 1: Digi-Key; Supplier Part Number 1: P10.0KLCT-ND; Quantity Override: 1
R249 = RES2693: Manufacturer 1: Bourns Inc.; Manufacturer Part Number 1: CR0402-J/-000GLF; Description_: RES TKF 0R 1/16W SMD 0402; Dev Tools Status: Design; Power: 1/16W; Owner: Dragos Danaila; Populated: DNP; Voltage: 50V; Temperature Coeffcient: 100ppm/C; Current: 1A; MCHP-ID: RES2693; Revision: 1; Symbol: Resistor; Status: MCL Design; ComponentLink1URL: https://chn-vm-apps.microchip.com/mchprepo/parts/Datasheets/crxxxxx.pdf; ComponentLink1Description: SVN Datasheet; ComponentLink2URL: C:\ALTIUM_WORK\00001_MCHP-CDB\Datasheets\crxxxxx.pdf; ComponentLink2Description: Local Datasheet; ComponentLink3URL: C:\ALTIUM_WORK\00001_MCHP-CDB\Library\LibraryRefs\Resistor.SchLib; ComponentLink3Description: Open Symbol; ComponentLink4URL: C:\ALTIUM_WORK\00001_MCHP-CDB\Library\Footprints\RES_C_0402.PcbLib; ComponentLink4Description: Open Footprint; ComponentLink5Description: Open Footprint 2; ComponentLink6Description: Open Footprint 3; ComponentLink7Description: Open Footprint 4; Operating Temperature: -55C to +155C; Category: Resistor; Type: RES SMD; Composition: TKF; Supplier 1: Digikey; Supplier Part Number 1: CR0402-J/-000GLFTR-ND; Quantity Override: 1
R250 = RSMT1211: Manufacturer 1: Vishay Dale; Manufacturer Part Number 1: CRCW04026K80FKED; Description_: RES TKF 6.8k 1% 1/16W SMD 0402; Dev Tools Status: Design; Voltage: 50V; Temperature Coeffcient: 100ppm/C; Power: 1/16W; Owner: Dragos Danaila; Populated: YES; MCHP-ID: RSMT1211; Revision: A; Symbol: Resistor; Status: MCL Design; ComponentLink1URL: https://chn-vm-apps.microchip.com/mchprepo/parts/Datasheets/dcrcwe3.pdf; ComponentLink1Description: SVN Datasheet; ComponentLink2URL: C:\ALTIUM_WORK\00001_MCHP-CDB\Datasheets\dcrcwe3.pdf; ComponentLink2Description: Local Datasheet; ComponentLink3URL: C:\ALTIUM_WORK\00001_MCHP-CDB\Library\LibraryRefs\Resistor.SchLib; ComponentLink3Description: Open Symbol; ComponentLink4URL: C:\ALTIUM_WORK\00001_MCHP-CDB\Library\Footprints\RES_C_0402.PcbLib; ComponentLink4Description: Open Footprint; ComponentLink5Description: Open Footprint 2; ComponentLink6Description: Open Footprint 3; ComponentLink7Description: Open Footprint 4; Operating Temperature: -55C to +155C; Category: Resistor; Type: RES SMD; Composition: TKF; Supplier 1: Digi-Key; Supplier Part Number 1: 541-6.80KLCT-ND; Quantity Override: 1
R255 R263-R265 R267 = RSMT0737: Manufacturer 1: Panasonic; Manufacturer Part Number 1: ERJ-2GEJ104X; Description_: RES TKF 100k 5% 1/10W SMD 0402; Dev Tools Status: Production; Temperature Coeffcient: 200ppm/C; Power: 1/10W; Populated: Yes; Voltage: 50V; MCHP-ID: RSMT0737; Revision: 1; Symbol: Resistor; Status: MCL Design; ComponentLink1URL: https://chn-vm-apps.microchip.com/mchprepo/parts/Datasheets/AOA0000CE1.pdf; ComponentLink1Description: SVN Datasheet; ComponentLink2URL: C:\ALTIUM_WORK\00001_MCHP-CDB\Datasheets\AOA0000CE1.pdf; ComponentLink2Description: Local Datasheet; ComponentLink3URL: C:\ALTIUM_WORK\00001_MCHP-CDB\Library\LibraryRefs\Resistor.SchLib; ComponentLink3Description: Open Symbol; ComponentLink4URL: C:\ALTIUM_WORK\00001_MCHP-CDB\Library\Footprints\RES_C_0402.PcbLib; ComponentLink4Description: Open Footprint; ComponentLink5Description: Open Footprint 2; ComponentLink6Description: Open Footprint 3; ComponentLink7Description: Open Footprint 4; Category: Resistor; Type: RES SMD; Composition: TKF; Supplier 1: Digi-Key; Supplier Part Number 1: P100KJCT-ND; Quantity Override: 1; Operating Temperature: -55C to +155C; Manufacturer 2: Stackpole Electronics Inc; Manufacturer Part Number 2: RMCF0402JT100K; Supplier 2: Digi-Key; Supplier Part Number 2: RMCF0402JT100KCT-ND
R256 R257 = RSMT1299: Manufacturer 1: Stackpole Electronics Inc; Manufacturer Part Number 1: RMCF0402FT39R0; Description_: RES TKF 39R 1/16W SMD 0402; Dev Tools Status: Design; Power: 1/16W; Owner: Dragos Danaila; Populated: YES; Voltage: 50V; Temperature Coeffcient: 100ppm/C; MCHP-ID: RSMT1299; Revision: 1; Symbol: Resistor; Status: MCL Design; ComponentLink1URL: https://chn-vm-apps.microchip.com/mchprepo/parts/Datasheets/sei-rmcf_rmcp.pdf; ComponentLink1Description: SVN Datasheet; ComponentLink2URL: C:\ALTIUM_WORK\00001_MCHP-CDB\Datasheets\sei-rmcf_rmcp.pdf; ComponentLink2Description: Local Datasheet; ComponentLink3URL: C:\ALTIUM_WORK\00001_MCHP-CDB\Library\LibraryRefs\Resistor.SchLib; ComponentLink3Description: Open Symbol; ComponentLink4URL: C:\ALTIUM_WORK\00001_MCHP-CDB\Library\Footprints\RES_C_0402.PcbLib; ComponentLink4Description: Open Footprint; ComponentLink5Description: Open Footprint 2; ComponentLink6Description: Open Footprint 3; ComponentLink7Description: Open Footprint 4; Operating Temperature: -55C to +155C; Category: Resistor; Type: RES SMD; Composition: TKF; Supplier 1: Digikey; Supplier Part Number 1: RMCF0402FT39R0CT-ND; Quantity Override: 1
R258 R259 = RSMT0316: Manufacturer 1: Panasonic; Manufacturer Part Number 1: ERJ-2GEJ102X; Description_: RES TKF 1k 5% 1/16W SMD 0402; Dev Tools Status: Production; Voltage: 50V; Temperature Coeffcient: 200ppm/C; Power: 1/16W; Owner: Tad Ahlvers; Populated: YES; MCHP-ID: RSMT0316; Revision: 1; Symbol: Resistor; Status: MCL Design; ComponentLink1URL: https://chn-vm-apps.microchip.com/mchprepo/parts/Datasheets/AOA0000CE1.pdf; ComponentLink1Description: SVN Datasheet; ComponentLink2URL: C:\ALTIUM_WORK\00001_MCHP-CDB\Datasheets\AOA0000CE1.pdf; ComponentLink2Description: Local Datasheet; ComponentLink3URL: C:\ALTIUM_WORK\00001_MCHP-CDB\Library\LibraryRefs\Resistor.SchLib; ComponentLink3Description: Open Symbol; ComponentLink4URL: C:\ALTIUM_WORK\00001_MCHP-CDB\Library\Footprints\RES_C_0402.PcbLib; ComponentLink4Description: Open Footprint; ComponentLink5Description: Open Footprint 2; ComponentLink6Description: Open Footprint 3; ComponentLink7Description: Open Footprint 4; Operating Temperature: -55C to +155C; Category: Resistor; Type: RES SMD; Composition: TKF; Supplier 1: Digi-Key; Supplier Part Number 1: P1.0KJCT-ND; Quantity Override: 1
R262 = RSMT1294: Manufacturer 1: Panasonic Electronic Components; Manufacturer Part Number 1: ERJ-PA2F51R0X; Description_: RES TKF 51R 1% 1/5W SMD 0402; Dev Tools Status: Design; Voltage: 50V; Temperature Coeffcient: 100ppm/C; Power: 1/5W; Owner: Dragos Danaila; Populated: YES; MCHP-ID: RSMT1294; Revision: 1; Symbol: Resistor; Status: MCL Design; ComponentLink1URL: https://chn-vm-apps.microchip.com/mchprepo/parts/Datasheets/AOA0000C331.pdf; ComponentLink1Description: SVN Datasheet; ComponentLink2URL: C:\ALTIUM_WORK\00001_MCHP-CDB\Datasheets\AOA0000C331.pdf; ComponentLink2Description: Local Datasheet; ComponentLink3URL: C:\ALTIUM_WORK\00001_MCHP-CDB\Library\LibraryRefs\Resistor.SchLib; ComponentLink3Description: Open Symbol; ComponentLink4URL: C:\ALTIUM_WORK\00001_MCHP-CDB\Library\Footprints\RES_C_0402.PcbLib; ComponentLink4Description: Open Footprint; ComponentLink5Description: Open Footprint 2; ComponentLink6Description: Open Footprint 3; ComponentLink7Description: Open Footprint 4; Operating Temperature: -55C to +155C; Category: Resistor; Type: RES SMD; Composition: TKF; Supplier 1: Digikey; Supplier Part Number 1: P124491CT-ND; Quantity Override: 1
R266 = RSMT0737: Manufacturer 1: Panasonic; Manufacturer Part Number 1: ERJ-2GEJ104X; Description_: RES TKF 100k 5% 1/10W SMD 0402; Dev Tools Status: Production; Temperature Coeffcient: 200ppm/C; Power: 1/10W; Populated: DNP; Voltage: 50V; MCHP-ID: RSMT0737; Revision: 1; Symbol: Resistor; Status: MCL Design; ComponentLink1URL: https://chn-vm-apps.microchip.com/mchprepo/parts/Datasheets/AOA0000CE1.pdf; ComponentLink1Description: SVN Datasheet; ComponentLink2URL: C:\ALTIUM_WORK\00001_MCHP-CDB\Datasheets\AOA0000CE1.pdf; ComponentLink2Description: Local Datasheet; ComponentLink3URL: C:\ALTIUM_WORK\00001_MCHP-CDB\Library\LibraryRefs\Resistor.SchLib; ComponentLink3Description: Open Symbol; ComponentLink4URL: C:\ALTIUM_WORK\00001_MCHP-CDB\Library\Footprints\RES_C_0402.PcbLib; ComponentLink4Description: Open Footprint; ComponentLink5Description: Open Footprint 2; ComponentLink6Description: Open Footprint 3; ComponentLink7Description: Open Footprint 4; Category: Resistor; Type: RES SMD; Composition: TKF; Supplier 1: Digi-Key; Supplier Part Number 1: P100KJCT-ND; Quantity Override: 1; Operating Temperature: -55C to +155C; Manufacturer 2: Stackpole Electronics Inc; Manufacturer Part Number 2: RMCF0402JT100K; Supplier 2: Digi-Key; Supplier Part Number 2: RMCF0402JT100KCT-ND
R269 R271 = RES1474: Manufacturer 1: Panasonic Electronic Components; Manufacturer Part Number 1: ERJ-2RKF22R0X; Description_: RES TKF 22R 1% 1/20W SMD 0402; Dev Tools Status: Production; Temperature Coeffcient: 100ppm/C; Circuit Type: Isolated; Power: 1/10W; Owner: Mike Ragsdale; Populated: YES; MCHP-ID: RES1474; Revision: 1; Symbol: Resistor; Status: MCL Design; ComponentLink1Description: SVN Datasheet; ComponentLink2Description: Local Datasheet; ComponentLink3URL: C:\ALTIUM_WORK\00001_MCHP-CDB\Library\LibraryRefs\Resistor.SchLib; ComponentLink3Description: Open Symbol; ComponentLink4URL: C:\ALTIUM_WORK\00001_MCHP-CDB\Library\Footprints\RES_C_0402.PcbLib; ComponentLink4Description: Open Footprint; ComponentLink5Description: Open Footprint 2; ComponentLink6Description: Open Footprint 3; ComponentLink7Description: Open Footprint 4; Operating Temperature: -55C to +155C; Category: Resistor; Type: RES SMD; Composition: TKF; Supplier 1: Digi-Key; Supplier Part Number 1: P22.0LCT-ND; Quantity Override: 1
R270 R272 = RES2693: Manufacturer 1: Bourns Inc.; Manufacturer Part Number 1: CR0402-J/-000GLF; Description_: RES TKF 0R 1/16W SMD 0402; Dev Tools Status: Design; Power: 1/16W; Owner: Dragos Danaila; Populated: YES; Voltage: 50V; Temperature Coeffcient: 100ppm/C; Current: 1A; MCHP-ID: RES2693; Revision: 1; Symbol: Resistor; Status: MCL Design; ComponentLink1URL: https://chn-vm-apps.microchip.com/mchprepo/parts/Datasheets/crxxxxx.pdf; ComponentLink1Description: SVN Datasheet; ComponentLink2URL: C:\ALTIUM_WORK\00001_MCHP-CDB\Datasheets\crxxxxx.pdf; ComponentLink2Description: Local Datasheet; ComponentLink3URL: C:\ALTIUM_WORK\00001_MCHP-CDB\Library\LibraryRefs\Resistor.SchLib; ComponentLink3Description: Open Symbol; ComponentLink4URL: C:\ALTIUM_WORK\00001_MCHP-CDB\Library\Footprints\RES_C_0402.PcbLib; ComponentLink4Description: Open Footprint; ComponentLink5Description: Open Footprint 2; ComponentLink6Description: Open Footprint 3; ComponentLink7Description: Open Footprint 4; Operating Temperature: -55C to +155C; Category: Resistor; Type: RES SMD; Composition: TKF; Supplier 1: Digikey; Supplier Part Number 1: CR0402-J/-000GLFTR-ND; Quantity Override: 1
TP30 = CON1759: Test Point; Value: TP PAD PCB 1mm; Description_: CON TP PAD PCB 1mm SMD; Dev Tools Status: Design; Owner: Cristian Papuc; Populated: YES; MCHP-ID: CON1759; Revision: A; Symbol: Test Point No BOM; Status: MCL Design; ComponentLink1Description: SVN Datasheet; ComponentLink2Description: Local Datasheet; ComponentLink3URL: C:\ALTIUM_WORK\00001_MCHP-CDB\Library\LibraryRefs\Test Point No BOM.SchLib; ComponentLink3Description: Open Symbol; ComponentLink4URL: C:\ALTIUM_WORK\00001_MCHP-CDB\Library\Footprints\TP_1mm_SMD.PcbLib; ComponentLink4Description: Open Footprint; ComponentLink5Description: Open Footprint 2; ComponentLink6Description: Open Footprint 3; ComponentLink7Description: Open Footprint 4; Type: Test Point; Category: Connector; Quantity Override: 1
U25 U27 = IC1517: Manufacturer 1: IDT, Integrated Device Technology Inc; Manufacturer Part Number 1: QS3VH257PAG; MCHP-ID: IC1517; Description_: IC SWITCHER  MUX/DEMUX IDTQS3VH257 QUAD 2:1 TSSOP-16; Dev Tools Status: Design; Owner: Ilie Galan; Populated: YES; Revision: A; Symbol: IDTQS3VH257 TSSOP-16; Status: MCL Design; Package: TSSOP-16; ComponentLink1URL: https://chn-vm-apps.microchip.com/mchprepo/parts/Datasheets/IDT_QS3VH257_DST_20140224.pdf; ComponentLink1Description: SVN Datasheet; ComponentLink2URL: C:\ALTIUM_WORK\00001_MCHP-CDB\Datasheets\IDT_QS3VH257_DST_20140224.pdf; ComponentLink2Description: Local Datasheet; ComponentLink3URL: C:\ALTIUM_WORK\00001_MCHP-CDB\Library\LibraryRefs\IDTQS3VH257 TSSOP-16.SchLib; ComponentLink3Description: Open Symbol; ComponentLink4URL: C:\ALTIUM_WORK\00001_MCHP-CDB\Library\Footprints\TSSOP-16.PcbLib; ComponentLink4Description: Open Footprint; ComponentLink5Description: Open Footprint 2; ComponentLink6Description: Open Footprint 3; ComponentLink7Description: Open Footprint 4; Operating Temperature: -40C to +85C; Type: Switcher; Category: IC; Supplier 1: Digi-Key; Supplier Part Number 1: 800-2205-ND; Quantity Override: 1
U26 = MIC7470: Manufacturer 1: Microchip Technology; Description_: MCHP MCU 32-BIT 96MHz 256kB 56kB ATSAM3U4CA-CU 100BGA; MAPS Description: TFBGA,GREEN,IND TEMP,MRL A; Dev Tools Status: Design; Owner: Dragos Danaila; MPC: 58Z247A2BC02; LeadContent: Pb-FREE; TempRange: -40C to +85C; Stage: REL; PackageWidth: 9x9x1.2mm; PackingMedia: TRAY; ForceMinOrderQtyMult: True; MinOrderQty: 260; LeadCount: 100; Program Memory KBytes: 256; Program Memory KWords: 64; Ram: 51200; EEPROM: 0; IOPins: 57; MaxSpeed: 96; OscillatorMHz: 4,8,12Mhz,32Khz; ADC Channels: 8; ADCBit: 12; USART: 4; I2C: 1; Input Capture: 6; CapTouchCH: 28; DigitalTimerQty_16bit: 3; Populated: YES; MCHP-ID: MIC7470; Symbol: ATSAM3U4CA-CU TFBGA-100; Type: 32-Bit; Status: MCL Design; Revision: A; Category: MCHP-Microcontroller; ComponentLink1URL: http://www.microchip.com/wwwproducts/Devices.aspx?product=ATSAM3U4C; ComponentLink1Description: SVN Datasheet; ComponentLink2URL: C:\ALTIUM_WORK\00001_MCHP-CDB\Datasheets\Atmel-6430-32-bit-Cortex-M3-Microcontroller-SAM3U4-SAM3U2-SAM3U1_Datasheet.pdf; ComponentLink2Description: Local Datasheet; ComponentLink3URL: C:\ALTIUM_WORK\00001_MCHP-CDB\Library\LibraryRefs\ATSAM3U4CA-CU TFBGA-100.SchLib; ComponentLink3Description: Open Symbol; ComponentLink4URL: C:\ALTIUM_WORK\00001_MCHP-CDB\Library\Footprints\TFBGA-100_P0.8_9x9x1.1.PcbLib; ComponentLink4Description: Open Footprint; ComponentLink5Description: Open Footprint 2; ComponentLink6Description: Open Footprint 3; ComponentLink7Description: Open Footprint 4; Manufacturer Part Number 1: ATSAM3U4CA-CU; Supplier 1: Digi-Key; Supplier Part Number 1: ATSAM3U4CA-CU-ND; IntroductionDate: 2016-12-22; PackageType: TFBGA; Family: ATSAM3U; Comparators: 0; DAChannels: 0; SPI: 4; CAN: 0; USBChannels: 1; PWM Channels: 0; mtrlcntrlpwmchannels: 0; SMPS PWM Channels: 0; QEI Channels: 1; SegmentLCD: 0; DigitalTimerQty_8bit: 0; DigitalTimerQty_32bit: 0; Quantity Override: 1
U28 = MIC6905: Manufacturer 1: Microchip Technology; Manufacturer Part Number 1: MIC5528-3.3YMT-TR; Description_: MCHP ANALOG LDO 3.3V MIC5528-3.3YMT-TR 6-TDFN; MAPS Description: Single, 500mA LDO w/ Auto Discharge & Internal Enable Pulldown; Dev Tools Status: Production; Owner: Tim Moffat; MPC: TKFC1YHHAA02; LeadContent: Pb-FREE; PackingMedia: T/R; Stage: REL; LeadCount: 6; PackageWidth: 1.2x1.2x0.6mm; ForceMinOrderQtyMult: True; MinOrderQty: 1; TempRange: -40C to +125C; tblDeviceFamilyID: 7519; Populated: YES; MCHP-ID: MIC6905; Symbol: MIC5528MT DFN-6; Type: LDO; Status: MCL Design; Revision: 1; Category: MCHP-Analog; ComponentLink1URL: http://www.microchip.com/wwwproducts/MIC5528; ComponentLink1Description: SVN Datasheet; ComponentLink2URL: C:\ALTIUM_WORK\00001_MCHP-CDB\Datasheets\MIC5528.pdf; ComponentLink2Description: Local Datasheet; ComponentLink3URL: C:\ALTIUM_WORK\00001_MCHP-CDB\Library\LibraryRefs\MIC5528MT DFN-6.SchLib; ComponentLink3Description: Open Symbol; ComponentLink4URL: C:\ALTIUM_WORK\00001_MCHP-CDB\Library\Footprints\DFN-6_1.2x1.2.PcbLib; ComponentLink4Description: Open Footprint; ComponentLink5Description: Open Footprint 2; ComponentLink6Description: Open Footprint 3; ComponentLink7Description: Open Footprint 4; Supplier 1: Digi-Key; Supplier Part Number 1: 576-4766-1-ND; IntroductionDate: 2014-05-19; PackageType: UDFN; Quantity Override: 1
U29 = IC1128: Level Shifter; Manufacturer 1: Texas Instruments; Manufacturer Part Number 1: TXS0102DCUR; MCHP-ID: IC1128; Description_: IC TRANSCEIVER TXS0102 US-8; Dev Tools Status: Production; Owner: Bogdan P (M91398); Populated: Yes; Value: TXS0102; Revision: 0; Symbol: TXS0102; Status: MCL Design; Package: US-8; ComponentLink1URL: https://chn-vm-apps.microchip.com/mchprepo/parts/Datasheets/txs0102.pdf; ComponentLink1Description: SVN Datasheet; ComponentLink2URL: C:\ALTIUM_WORK\00001_MCHP-CDB\Datasheets\txs0102.pdf; ComponentLink2Description: Local Datasheet; ComponentLink3URL: C:\ALTIUM_WORK\00001_MCHP-CDB\Library\LibraryRefs\TXS0102.SchLib; ComponentLink3Description: Open Symbol; ComponentLink4URL: C:\ALTIUM_WORK\00001_MCHP-CDB\Library\Footprints\US-8.PcbLib; ComponentLink4Description: Open Footprint; ComponentLink5Description: Open Footprint 2; ComponentLink6Description: Open Footprint 3; ComponentLink7Description: Open Footprint 4; Operating Temperature: -40C to +85C; Type: Transceiver; Category: IC; Supplier 1: Digi-Key; Supplier Part Number 1: 296-21931-1-ND; Quantity Override: 1
Y10 = MIC9169: Manufacturer 1: Microchip Technology; Manufacturer Part Number 1: DSC6011JI1B-012.0000; Description_: MCHP CLOCK OSCILLATOR SINGLE 12.000MHZ DSC6011JI1B-012.0000 VLGA; Dev Tools Status: Production; Owner: Ed Kennedy; Populated: YES; MCHP-ID: MIC9169; Revision: 1; Symbol: OSCILLATOR DSC60XX; Status: MCL Design; ComponentLink1Description: SVN Datasheet; ComponentLink2Description: Local Datasheet; ComponentLink3URL: C:\ALTIUM_WORK\00001_MCHP-CDB\Library\LibraryRefs\OSCILLATOR DSC60XX.SchLib; ComponentLink3Description: Open Symbol; ComponentLink4URL: C:\ALTIUM_WORK\00001_MCHP-CDB\Library\Footprints\OSCILLATOR_DSC60000L2.5W2.0H0.89.PcbLib; ComponentLink4Description: Open Footprint; ComponentLink5Description: Open Footprint 2; ComponentLink6Description: Open Footprint 3; ComponentLink7Description: Open Footprint 4; Type: Oscillator; Category: MCHP-Clock/Timing; Supplier 1: Digi-Key; Supplier Part Number 1: DSC6011JI1B-012.0000-ND; Quantity Override: 1; ComponentLink1URL: https://chn-vm-apps.microchip.com/mchprepo/parts/Datasheets/DSC60xxB-Ultra-Small-Ultra-Low-Power-MEMS-Oscillator-DS20006133A; ComponentLink2URL: C:\ALTIUM_WORK\00001_MCHP-CDB\Datasheets\DSC60xxB-Ultra-Small-Ultra-Low-Power-MEMS-Oscillator-DS20006133A